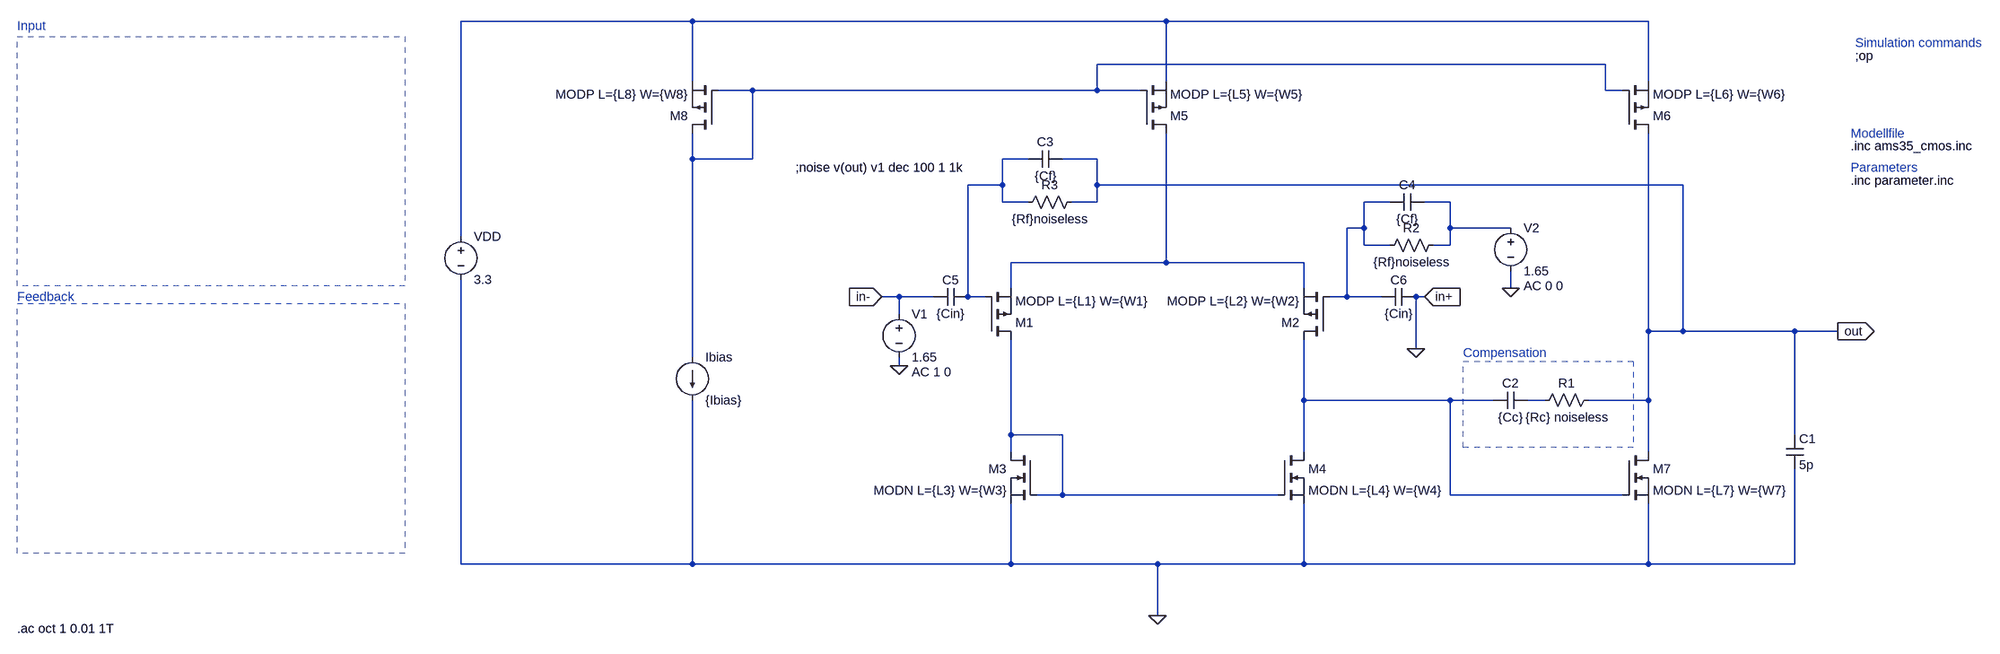
[diagram p0: schematic miller_ota feedback.asc]
miller_ota feedback.asc, the LTspice schematic file:
Version 4
SHEET 1 4076 2488
WIRE 1296 816 816 816
WIRE 2176 816 1296 816
WIRE 3072 816 2176 816
WIRE 2992 896 2048 896
WIRE 1296 928 1296 816
WIRE 2176 928 2176 816
WIRE 3072 928 3072 816
WIRE 1408 944 1344 944
WIRE 2048 944 2048 896
WIRE 2048 944 1408 944
WIRE 2128 944 2048 944
WIRE 2992 944 2992 896
WIRE 3024 944 2992 944
WIRE 1296 1072 1296 1024
WIRE 1408 1072 1408 944
WIRE 1408 1072 1296 1072
WIRE 1920 1072 1872 1072
WIRE 2048 1072 1984 1072
WIRE 1872 1120 1872 1072
WIRE 1872 1120 1808 1120
WIRE 2048 1120 2048 1072
WIRE 3136 1120 2048 1120
WIRE 1872 1152 1872 1120
WIRE 1920 1152 1872 1152
WIRE 2048 1152 2048 1120
WIRE 2048 1152 2000 1152
WIRE 2592 1152 2544 1152
WIRE 2704 1152 2656 1152
WIRE 2544 1200 2544 1152
WIRE 2544 1200 2512 1200
WIRE 2704 1200 2704 1152
WIRE 2816 1200 2704 1200
WIRE 816 1216 816 816
WIRE 2544 1232 2544 1200
WIRE 2592 1232 2544 1232
WIRE 2704 1232 2704 1200
WIRE 2704 1232 2672 1232
WIRE 2176 1264 2176 1024
WIRE 2176 1264 1888 1264
WIRE 2240 1264 2176 1264
WIRE 2432 1264 2240 1264
WIRE 1888 1312 1888 1264
WIRE 2432 1312 2432 1264
WIRE 2816 1312 2816 1280
WIRE 1680 1328 1648 1328
WIRE 1744 1328 1680 1328
WIRE 1808 1328 1808 1120
WIRE 1840 1328 1808 1328
WIRE 2512 1328 2512 1200
WIRE 2512 1328 2480 1328
WIRE 2544 1328 2512 1328
WIRE 2576 1328 2544 1328
WIRE 2656 1328 2640 1328
WIRE 1680 1360 1680 1328
WIRE 3072 1392 3072 1024
WIRE 3136 1392 3136 1120
WIRE 3136 1392 3072 1392
WIRE 3280 1392 3136 1392
WIRE 3344 1392 3280 1392
WIRE 3424 1392 3344 1392
WIRE 2640 1424 2640 1328
WIRE 1296 1440 1296 1072
WIRE 1680 1456 1680 1440
WIRE 2432 1520 2432 1408
WIRE 2544 1520 2432 1520
WIRE 2704 1520 2544 1520
WIRE 2784 1520 2704 1520
WIRE 2880 1520 2848 1520
WIRE 3072 1520 3072 1392
WIRE 3072 1520 2960 1520
WIRE 1888 1584 1888 1408
WIRE 1984 1584 1888 1584
WIRE 3344 1584 3344 1392
WIRE 1888 1616 1888 1584
WIRE 2432 1616 2432 1520
WIRE 3072 1616 3072 1520
WIRE 1984 1696 1984 1584
WIRE 1984 1696 1936 1696
WIRE 2384 1696 1984 1696
WIRE 2704 1696 2704 1520
WIRE 3024 1696 2704 1696
WIRE 816 1824 816 1296
WIRE 1296 1824 1296 1520
WIRE 1296 1824 816 1824
WIRE 1888 1824 1888 1712
WIRE 1888 1824 1296 1824
WIRE 2160 1824 1888 1824
WIRE 2432 1824 2432 1712
WIRE 2432 1824 2160 1824
WIRE 3072 1824 3072 1712
WIRE 3072 1824 2432 1824
WIRE 3344 1824 3344 1648
WIRE 3344 1824 3072 1824
WIRE 2160 1920 2160 1824
FLAG 3424 1392 out
IOPIN 3424 1392 Out
FLAG 2656 1328 in+
IOPIN 2656 1328 In
FLAG 1648 1328 in-
IOPIN 1648 1328 In
FLAG 2160 1920 0
FLAG 1680 1456 0
FLAG 2816 1312 0
FLAG 2640 1424 0
DATAFLAG 3280 1392 ""
DATAFLAG 2544 1520 ""
DATAFLAG 2240 1264 ""
DATAFLAG 2544 1328 ""
SYMBOL pmos 1840 1408 M180
SYMATTR InstName M1
SYMATTR Value MODP L={L1} W={W1}
SYMBOL pmos 2480 1408 R180
SYMATTR InstName M2
SYMATTR Value MODP L={L2} W={W2}
SYMBOL pmos 2128 1024 M180
SYMATTR InstName M5
SYMATTR Value MODP L={L5} W={W5}
SYMBOL nmos 2384 1616 R0
SYMATTR InstName M4
SYMATTR Value MODN L={L4} W={W4}
SYMBOL nmos 1936 1616 M0
SYMATTR InstName M3
SYMATTR Value MODN L={L3} W={W3}
SYMBOL voltage 816 1200 R0
WINDOW 123 0 0 Left 2
WINDOW 39 0 0 Left 2
SYMATTR InstName VDD
SYMATTR Value 3.3
SYMBOL nmos 3024 1616 R0
SYMATTR InstName M7
SYMATTR Value MODN L={L7} W={W7}
SYMBOL pmos 3024 1024 M180
SYMATTR InstName M6
SYMATTR Value MODP L={L6} W={W6}
SYMBOL pmos 1344 1024 R180
SYMATTR InstName M8
SYMATTR Value MODP L={L8} W={W8}
SYMBOL current 1296 1440 R0
WINDOW 123 0 0 Left 2
WINDOW 39 0 0 Left 2
SYMATTR InstName Ibias
SYMATTR Value {Ibias}
SYMBOL cap 3328 1584 R0
SYMATTR InstName C1
SYMATTR Value 5p
SYMBOL voltage 1680 1344 R0
WINDOW 123 24 124 Left 2
WINDOW 39 0 0 Left 2
SYMATTR Value2 AC 1 0
SYMATTR InstName V1
SYMATTR Value 1.65
SYMBOL voltage 2816 1184 R0
WINDOW 123 24 124 Left 2
WINDOW 39 0 0 Left 2
SYMATTR Value2 AC 0 0
SYMATTR InstName V2
SYMATTR Value 1.65
SYMBOL cap 1984 1056 R90
WINDOW 0 0 32 VBottom 2
WINDOW 3 32 32 VTop 2
SYMATTR InstName C3
SYMATTR Value {Cf}
SYMBOL cap 2656 1136 R90
WINDOW 0 0 32 VBottom 2
WINDOW 3 32 32 VTop 2
SYMATTR InstName C4
SYMATTR Value {Cf}
SYMBOL res 2688 1216 R90
WINDOW 0 0 56 VBottom 2
WINDOW 3 32 56 VTop 2
SYMATTR InstName R2
SYMATTR Value {Rf}noiseless
SYMBOL res 2016 1136 R90
WINDOW 0 0 56 VBottom 2
WINDOW 3 32 56 VTop 2
SYMATTR InstName R3
SYMATTR Value {Rf}noiseless
SYMBOL cap 1808 1312 R90
WINDOW 0 0 32 VBottom 2
WINDOW 3 32 32 VTop 2
SYMATTR InstName C5
SYMATTR Value {Cin}
SYMBOL cap 2640 1312 R90
WINDOW 0 0 32 VBottom 2
WINDOW 3 32 32 VTop 2
SYMATTR InstName C6
SYMATTR Value {Cin}
SYMBOL cap 2848 1504 R90
WINDOW 0 0 32 VBottom 2
WINDOW 3 32 32 VTop 2
SYMATTR InstName C2
SYMATTR Value {Cc}
SYMBOL res 2976 1504 R90
WINDOW 0 0 56 VBottom 2
WINDOW 3 32 56 VTop 2
SYMATTR InstName R1
SYMATTR Value {Rc} noiseless
TEXT 3448 1048 Left 2 !.inc ams35_cmos.inc
TEXT -8 824 Left 2 ;Input
TEXT -8 1328 Left 2 ;Feedback
TEXT 3456 856 Left 2 ;Simulation commands
TEXT 3456 880 Left 2 !;op
TEXT 3448 1088 Left 2 ;Parameters
TEXT 3448 1112 Left 2 !.inc parameter.inc
TEXT 3448 1024 Left 2 ;Modellfile
TEXT 2728 1432 Left 2 ;Compensation
TEXT -8 1944 Left 2 !.ac oct 1 0.01 1T
TEXT 1488 1088 Left 2 !;noise v(out) v1 dec 100 1 1k
RECTANGLE Normal -8 844 712 1308 2
RECTANGLE Normal -8 1340 712 1804 2
RECTANGLE Normal 2728 1448 3044 1608 2

The netlist it stands for:
* miller_ota feedback.asc
M1 N009 N003 N006 N006 MODP L={L1} W={W1}
M2 N007 N004 N006 N006 MODP L={L2} W={W2}
M5 N006 N002 N001 N001 MODP L={L5} W={W5}
M4 N007 N009 0 0 MODN L={L4} W={W4}
M3 N009 N009 0 0 MODN L={L3} W={W3}
VDD N001 0 3.3
M7 out N007 0 0 MODN L={L7} W={W7}
M6 out N002 N001 N001 MODP L={L6} W={W6}
M8 N002 N002 N001 N001 MODP L={L8} W={W8}
Ibias N002 0 {Ibias}
C1 out 0 5p
V1 in- 0 1.65 AC 1 0
V2 N005 0 1.65 AC 0 0
C3 out N003 {Cf}
C4 N005 N004 {Cf}
R2 N005 N004 {Rf}noiseless
R3 out N003 {Rf}noiseless
C5 N003 in- {Cin}
C6 0 N004 {Cin}
C2 N008 N007 {Cc}
R1 out N008 {Rc} noiseless
.model NMOS NMOS
.model PMOS PMOS
.lib standard.mos
.inc ams35_cmos.inc
* Input
* Feedback
* Simulation commands
;op
* Parameters
.inc parameter.inc
* Modellfile
* Compensation
.ac oct 1 0.01 1T
;noise v(out) v1 dec 100 1 1k
.backanno
.end